# Altium schematic sheet Sheet1.SchDoc
size Letter
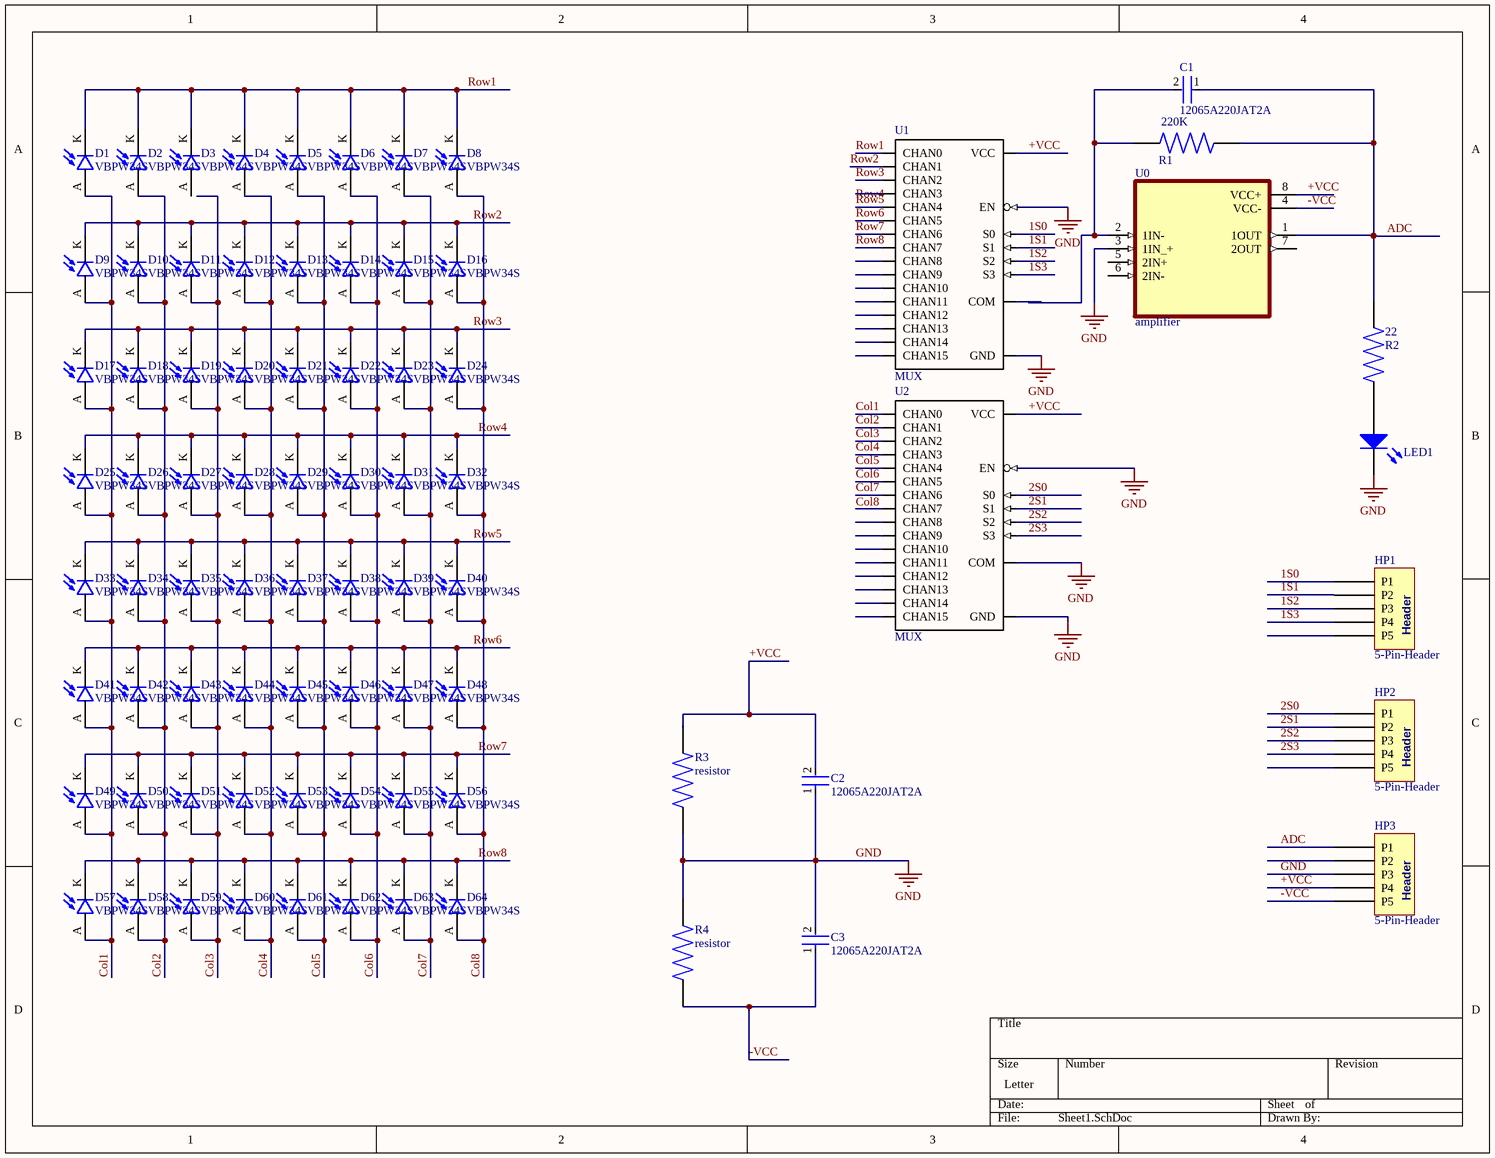
[diagram p0: Sheet1.SchDoc]

## Parts
22  R2  [resistor]
220K  R1  [resistor]
?  LED1  [LED-1]
C1  12065A220JAT2A  [FP-1206-L_3_2_0_2-W_1_6_0-IPC_C]
C2  12065A220JAT2A  [FP-1206-L_3_2_0_2-W_1_6_0-IPC_C]
C3  12065A220JAT2A  [FP-1206-L_3_2_0_2-W_1_6_0-IPC_C]
D1  VBPW34S  [VBPW34S]
D2  VBPW34S  [VBPW34S]
D3  VBPW34S  [VBPW34S]
D4  VBPW34S  [VBPW34S]
D5  VBPW34S  [VBPW34S]
D6  VBPW34S  [VBPW34S]
D7  VBPW34S  [VBPW34S]
D8  VBPW34S  [VBPW34S]
D9  VBPW34S  [VBPW34S]
D10  VBPW34S  [VBPW34S]
D11  VBPW34S  [VBPW34S]
D12  VBPW34S  [VBPW34S]
D13  VBPW34S  [VBPW34S]
D14  VBPW34S  [VBPW34S]
D15  VBPW34S  [VBPW34S]
D16  VBPW34S  [VBPW34S]
D17  VBPW34S  [VBPW34S]
D18  VBPW34S  [VBPW34S]
D19  VBPW34S  [VBPW34S]
D20  VBPW34S  [VBPW34S]
D21  VBPW34S  [VBPW34S]
D22  VBPW34S  [VBPW34S]
D23  VBPW34S  [VBPW34S]
D24  VBPW34S  [VBPW34S]
D25  VBPW34S  [VBPW34S]
D26  VBPW34S  [VBPW34S]
D27  VBPW34S  [VBPW34S]
D28  VBPW34S  [VBPW34S]
D29  VBPW34S  [VBPW34S]
D30  VBPW34S  [VBPW34S]
D31  VBPW34S  [VBPW34S]
D32  VBPW34S  [VBPW34S]
D33  VBPW34S  [VBPW34S]
D34  VBPW34S  [VBPW34S]
D35  VBPW34S  [VBPW34S]
D36  VBPW34S  [VBPW34S]
D37  VBPW34S  [VBPW34S]
D38  VBPW34S  [VBPW34S]
D39  VBPW34S  [VBPW34S]
D40  VBPW34S  [VBPW34S]
D41  VBPW34S  [VBPW34S]
D42  VBPW34S  [VBPW34S]
D43  VBPW34S  [VBPW34S]
D44  VBPW34S  [VBPW34S]
D45  VBPW34S  [VBPW34S]
D46  VBPW34S  [VBPW34S]
D47  VBPW34S  [VBPW34S]
D48  VBPW34S  [VBPW34S]
D49  VBPW34S  [VBPW34S]
D50  VBPW34S  [VBPW34S]
D51  VBPW34S  [VBPW34S]
D52  VBPW34S  [VBPW34S]
D53  VBPW34S  [VBPW34S]
D54  VBPW34S  [VBPW34S]
D55  VBPW34S  [VBPW34S]
D56  VBPW34S  [VBPW34S]
D57  VBPW34S  [VBPW34S]
D58  VBPW34S  [VBPW34S]
D59  VBPW34S  [VBPW34S]
D60  VBPW34S  [VBPW34S]
D61  VBPW34S  [VBPW34S]
D62  VBPW34S  [VBPW34S]
D63  VBPW34S  [VBPW34S]
D64  VBPW34S  [VBPW34S]
HP1  5-Pin-Header  [Pin Header1]
HP2  5-Pin-Header  [Pin Header1]
HP3  5-Pin-Header  [Pin Header1]
R3  resistor  [resistor]
R4  resistor  [resistor]
U0  amplifier  [amplifier]
U1  MUX  [MUX]
U2  MUX  [MUX]

## Nets
GND: ?.2(K) C2.1 C3.2 HP3.P3 R3.1 R4.2 U0.3(1IN_+) U1.P12(GND) U1.P15(EN) U2.P1(COM) U2.P12(GND) U2.P15(EN)
1S0: HP1.P1 U1.P10(S0)
1S1: HP1.P2 U1.P11(S1)
1S2: HP1.P3 U1.P14(S2)
1S3: HP1.P4 U1.P13(S3)
2S0: HP2.P1 U2.P10(S0)
2S1: HP2.P2 U2.P11(S1)
2S2: HP2.P3 U2.P14(S2)
2S3: HP2.P4 U2.P13(S3)
+VCC: C2.2 HP3.P4 R3.2 U0.8(VCC+) U1.P24(VCC) U2.P24(VCC)
-VCC: C3.1 HP3.P5 R4.1 U0.4(VCC-)
ADC: 22.2 220K.2 C1.1 HP3.P1 U0.1(1OUT)
Col1: D1.A D9.A D17.A D25.A D33.A D41.A D49.A D57.A U2.P9(CHAN0)
Col2: D2.A D10.A D18.A D26.A D34.A D42.A D50.A D58.A U2.P8(CHAN1)
Col3: D11.A D19.A D27.A D35.A D43.A D51.A D59.A U2.P7(CHAN2)
Col4: D4.A D12.A D20.A D28.A D36.A D44.A D52.A D60.A U2.P6(CHAN3)
Col5: D5.A D13.A D21.A D29.A D37.A D45.A D53.A D61.A U2.P5(CHAN4)
Col6: D6.A D14.A D22.A D30.A D38.A D46.A D54.A D62.A U2.P4(CHAN5)
Col7: D7.A D15.A D23.A D31.A D39.A D47.A D55.A D63.A U2.P3(CHAN6)
Col8: D8.A D16.A D24.A D32.A D40.A D48.A D56.A D64.A
Row1: D1.K(C) D2.K(C) D3.K(C) D4.K(C) D5.K(C) D6.K(C) D7.K(C) D8.K(C) U1.P9(CHAN0)
Row2: D9.K(C) D10.K(C) D11.K(C) D12.K(C) D13.K(C) D14.K(C) D15.K(C) D16.K(C) U1.P8(CHAN1)
Row3: D17.K(C) D18.K(C) D19.K(C) D20.K(C) D21.K(C) D22.K(C) D23.K(C) D24.K(C) U1.P7(CHAN2)
Row4: D25.K(C) D26.K(C) D27.K(C) D28.K(C) D29.K(C) D30.K(C) D31.K(C) D32.K(C)
Row5: D33.K(C) D34.K(C) D35.K(C) D36.K(C) D37.K(C) D38.K(C) D39.K(C) D40.K(C) U1.P5(CHAN4)
Row6: D41.K(C) D42.K(C) D43.K(C) D44.K(C) D45.K(C) D46.K(C) D47.K(C) D48.K(C) U1.P4(CHAN5)
Row7: D49.K(C) D50.K(C) D51.K(C) D52.K(C) D53.K(C) D54.K(C) D55.K(C) D56.K(C) U1.P3(CHAN6)
Row8: D57.K(C) D58.K(C) D59.K(C) D60.K(C) D61.K(C) D62.K(C) D63.K(C) D64.K(C) U1.P2(CHAN7)
Net220K_1: 220K.1 C1.2 U0.2(1IN-)

Not connected (* = marked no-connect by the designer): 22 1; ? 1(A); D3 A; HP1 P5; HP2 P5; HP3 P2; U0 5(2IN+) 6(2IN-) 7(2OUT); U1 P1(COM) P6(CHAN3) P16(CHAN15) P17(CHAN14) P18(CHAN13) P19(CHAN12) P20(CHAN11) P21(CHAN10) P22(CHAN9) P23(CHAN8); U2 P2(CHAN7) P16(CHAN15) P17(CHAN14) P18(CHAN13) P19(CHAN12) P20(CHAN11) P21(CHAN10) P22(CHAN9) P23(CHAN8)

## Notes on the sheet
- Labels drawn without touching a wire or pin: Col8, Row4
- (in symbol 5-Pin-Header) Header

## Library data of the parts
22 220K = resistor
? = LED1: Typical RED GaAs LED; Published: 8-Jun-2000; LatestRevisionDate: 08-Jul-2005; LatestRevisionNote: Mech Layer 1 removed.; PackageReference: LED-1; Publisher: Altium Limited; PackageDescription: LED; 2 Leads
C1-C3 = CMP-1037-00977-2: General Purpose Ceramic Capacitor, 1206, 22pF, 5%, NP0, 30ppm/°C, 50V; Dielectric: C0G; Construction: Flat; Thickness: 0.037inch; Width: 0.063inch; Min Operating Temperature: -55°C; Contact Plating: Tin; Radiation Hardening: No; Depth: 1.6mm; REACH SVHC: No SVHC; Voltage: 50V; Series: -; Max Operating Temperature: 125°C; RoHS Compliant: Yes; Voltage Rating (DC): 50V; Packaging: Tape and Reel; Lead Free: Lead Free; Termination: SMD/SMT; Number of Pins: 2; Case Code (Metric): 3216; Tolerance: 5%; Voltage Rating: 50V; Mount: Surface Mount; Length: 3.2mm; Case/Package: 1206; Package Quantity: 1; Case Code (Imperial): 1206; Capacitance: 22pF
D1-D64 = VBPW34S: Photodiode 940nm 100ns 130Â° 2-SMD, Gull Wing; MF: Vishay; Price: None; MP: VBPW34S; Value: *; Package: SMD-2 Vishay; SnapEDA_Link: https://www.snapeda.com/parts/VBPW34S/Vishay%20Semiconductor%20Opto%20Division/view-part/139260/?ref=snap; Availability: Unavailable
HP1-HP3 = 5-Pin-Header: 2.54mm Pitch, 5 pin, 1 Row, SMD, Header Pin
U1 U2 = MUX: Analog Switch/Analog Multiplexer Single 16:1 24-Pin SSOP T/R